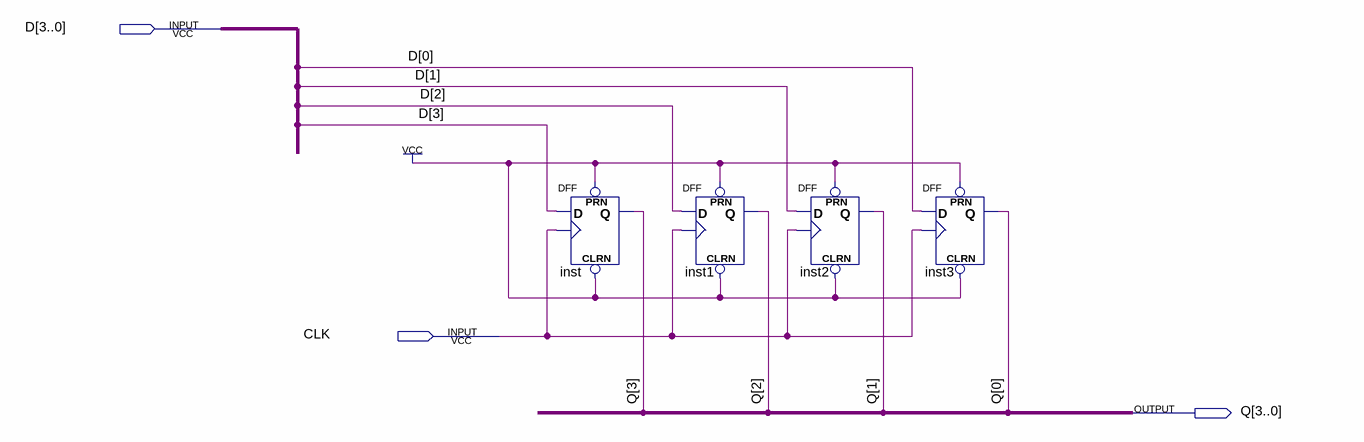
[diagram p0: schematic sheet]
// Quartus schematic PRESENT.bdf as structural Verilog: 4 symbols, 3 pins
module PRESENT (
  input  [3:0] D,
  input  CLK,
  output [3:0] Q
);

  DFF inst (.CLRN(1'b1), .CLK(CLK), .D(D[3]), .PRN(1'b1), .Q(Q[3]));
  DFF inst1 (.CLRN(1'b1), .CLK(CLK), .D(D[2]), .PRN(1'b1), .Q(Q[2]));
  DFF inst2 (.CLRN(1'b1), .CLK(CLK), .D(D[1]), .PRN(1'b1), .Q(Q[1]));
  DFF inst3 (.CLRN(1'b1), .CLK(CLK), .D(D[0]), .PRN(1'b1), .Q(Q[0]));
endmodule
